# Altium schematic sheet Timing_Converter.SchDoc
size A4; SheetNumber: 3; SheetTotal: 3
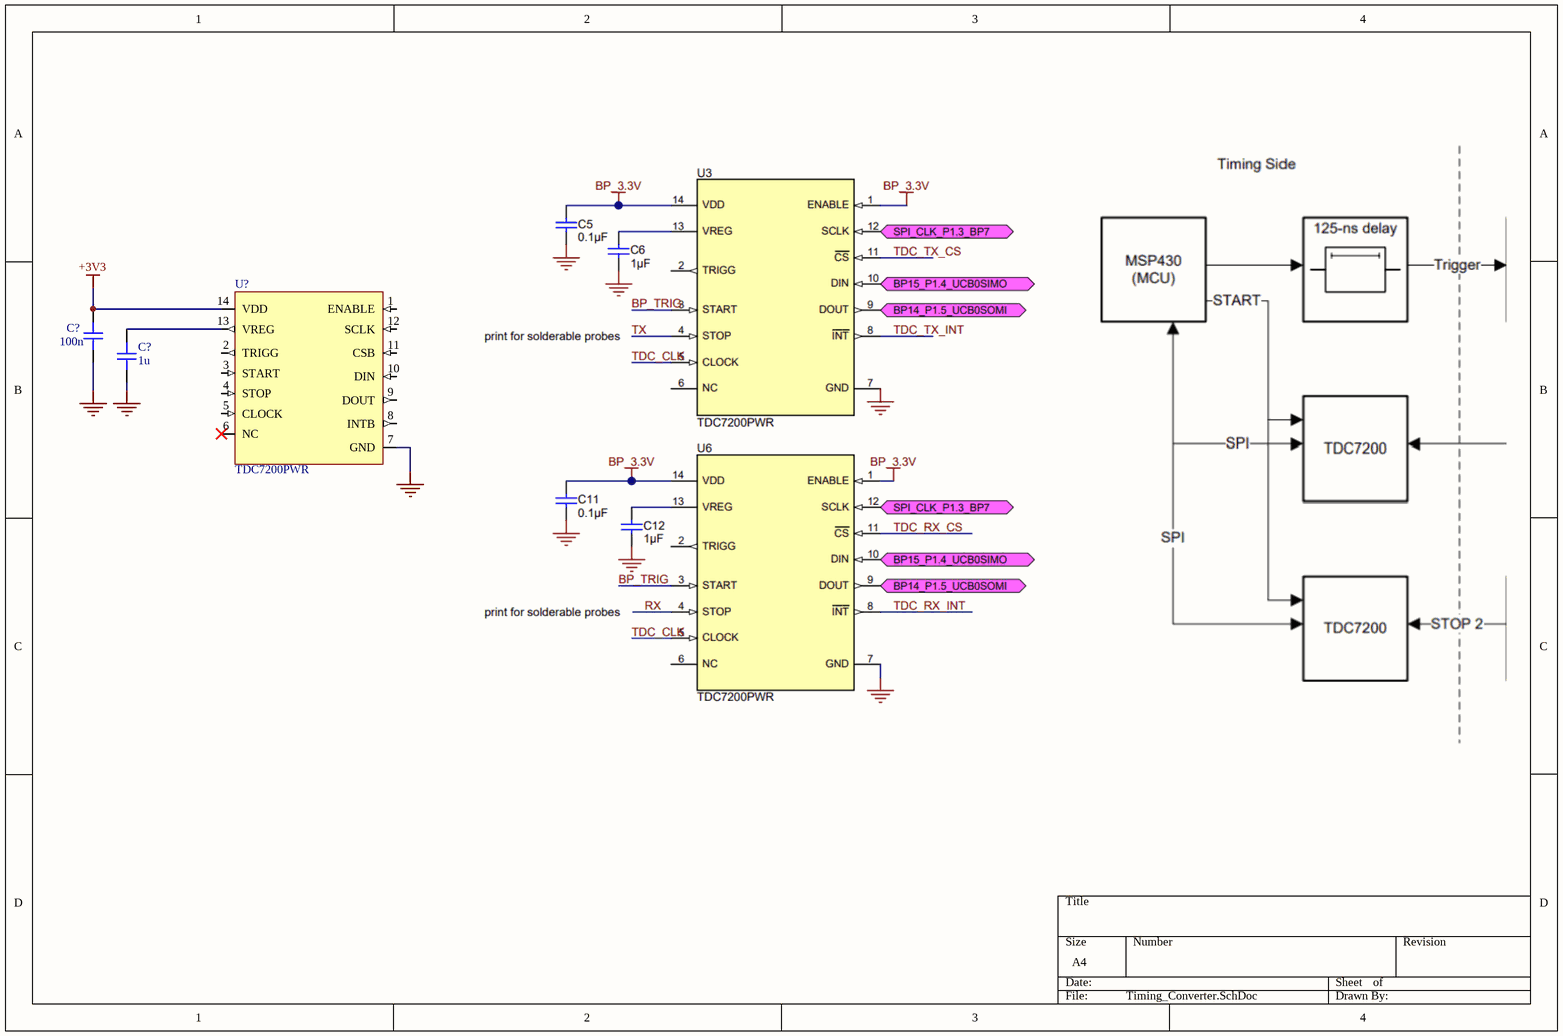
[diagram p0: Timing_Converter.SchDoc]

## Parts
(Parts that share a designator on the sheet are numbered #1, #2 ... from top to bottom, then left to right.)
C?#1  100n  [CAP_0603]
C?#2  1u  [CAP_0603]
U?  TDC7200PWR  [TDC7200PWR]

## Nets
+3V3: C?#1.2 U?.14(VDD)
GND: C?#1.1 C?#2.1 U?.7(GND)
NetC?#2_2: C?#2.2 U?.13(VREG)

Not connected (* = marked no-connect by the designer): U? 1(ENABLE) 2(TRIGG) 3(START) 4(STOP) 5(CLOCK) 6(NC)* 8(INTB) 9(DOUT) 10(DIN) 11(CSB) 12(SCLK)

## Library data of the parts
C?#1 = MAJCH168BB7104KTEA01: Multilayer Ceramic Capacitors MLCC - SMD/SMT 100V 0.1uF 0603 X7R 10% AECQ2; Manufacturer: TAIYO YUDEN; Rating: 100nF 100V X7R 0603 10%; Manufacturer Part Number: MAJCH168BB7104KTEA01; Distributor Link: https://www.mouser.tw/en/ProductDetail/TAIYO-YUDEN/MAJCH168BB7104KTEA01?qs=ZcfC38r4PovaTBrG0IdezQ%3D%3D; Datasheet Link: https://www.mouser.com/catalog/specsheets/TAIYO_YUDEN_03-08-2024_MAJCH168BB7104KTEA01_SS.pdf?_gl=1*17qbpp1*_gcl_aw*R0NMLjE3ODUyMjg2NDkuQ2p3S0NBandwcUhUQmhBY0Vpd0FqMkFmdXJYOV9OUy1CV0xFSmd6T0FaYy1HZXR1bHVfaUZmaHVzRkI2bHhkODVUMjVSNlJWbnBOUkFob0NEdHNRQXZEX0J3RQ..*_gcl_au*MTM0NzYwMzc0Mi4xNzgyNDQ3MDMwLjE4MDQ0Nzg2ODUuMTc4NTI5MDg4OS4xNzg1MjkxOTE2LjE1NDk0Mzk5MTcuMTc4NTIxODYwOC4xNzg1MjkxOTE2*_ga*MTg5NTU5OTIyLjE3ODI0NDcwMzM.*_ga_15W4STQT4T*czE3ODUyODM3NTgkbzk5JGcxJHQxNzg1MjkxOTI1JGo0MiRsMCRoMA..; Dielectric: *
C?#2 = C0603X105K9RACAUTO: Multilayer Ceramic Capacitors MLCC - SMD/SMT 6.3 Vo 1 uF 0603 X7R 10 % AECQ200; Manufacturer: KEMET; Rating: 1u 6.3V X7R 0603; Manufacturer Part Number: C0603X105K9RACAUTO; Distributor Link: https://www.mouser.tw/datasheet/3/72/1/C0603X105K9RACAUTO.pdf; LCSC: N/A; Dielectric: *
U? = TDC7200PWR: Sensor Interface Time-to-digital conv erter for time-of-f A 595-TDC7200PW; Manufacturer Name: Texas Instruments; ComponentLink1Description: Datasheet Link; ComponentLink1URL: https://www.ti.com/lit/gpn/tdc7200; ComponentLink2Description: Distributor Link; ComponentLink2URL: https://www.mouser.tw/en/ProductDetail/Texas-Instruments/TDC7200PWR?qs=Q2snjRlG%2FBJNiMilyUsr3A%3D%3D